# Altium schematic sheet PageMain.SchDoc
size 420 x 297 mm; Address1: Address1; Address2: Address2; Address3: Address3; Address4: Address4; DocumentNumber: ADHF20_EL; SheetNumber: 1; Scale: 1:1; DocumentType: Схема электрическая принципиальная; FirstReferrence: ADHF20_EL
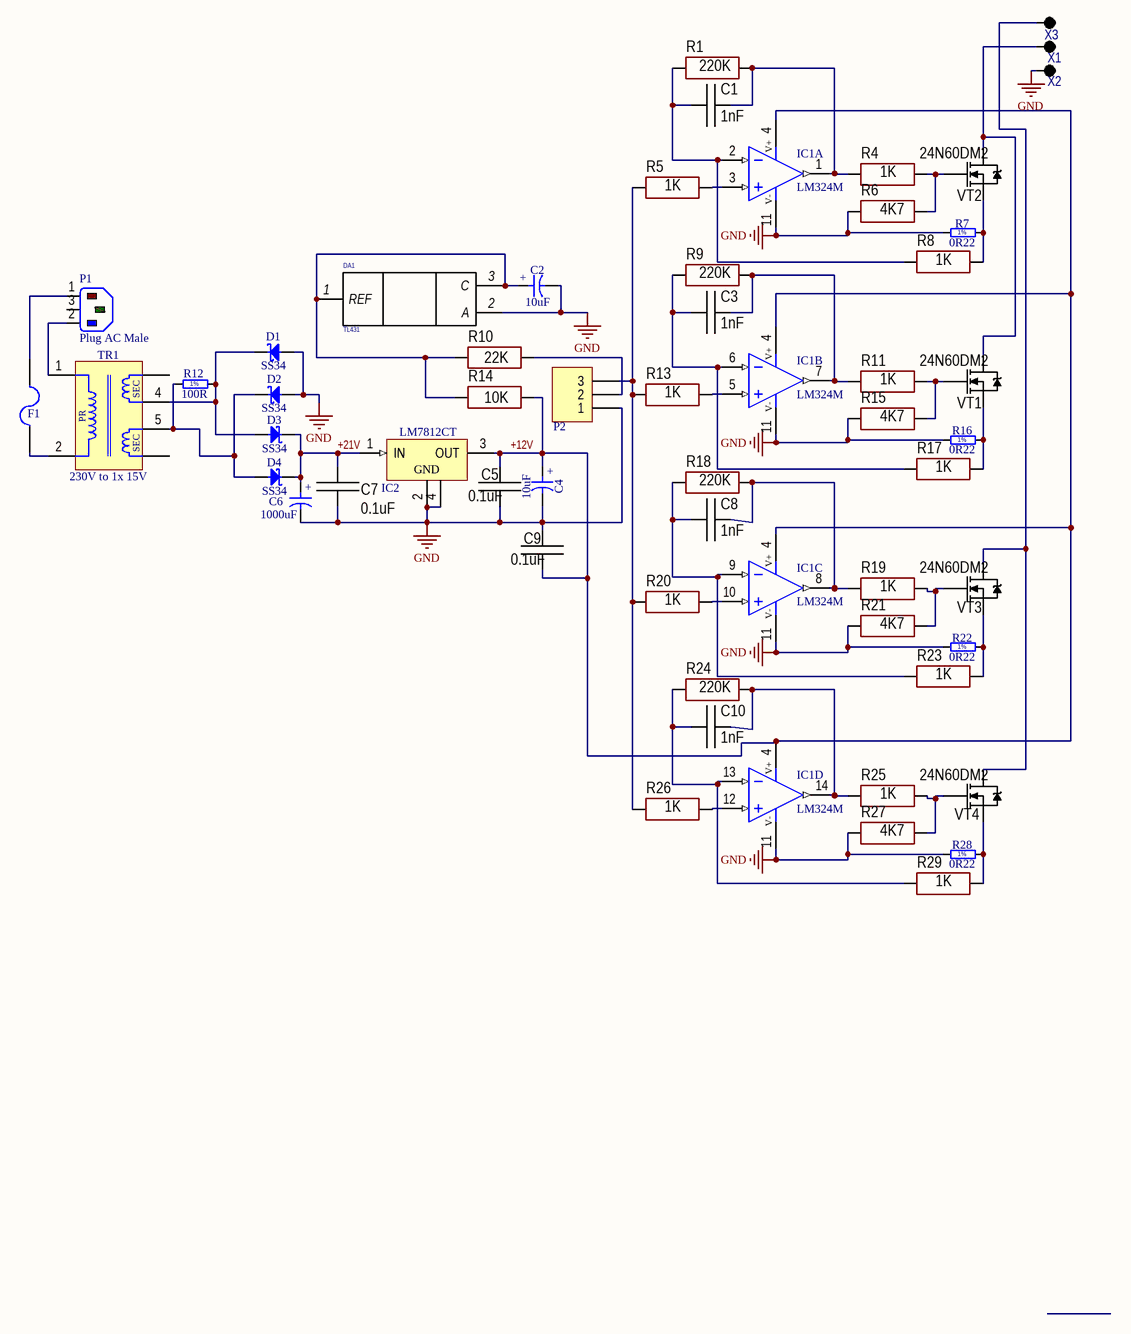
[diagram p0: PageMain.SchDoc]

## Parts
C1  value 1nF  [CAP: 0805]
C2  10uF  [CAPPR200-500X1100]
C3  value 1nF  [CAP: 0805]
C4  10uF  [CAPPR200-500X1100]
C5  value 0.1uF  [CAP: 0805]
C6  1000uF  [CAPPR500-1300X2700]
C7  value 0.1uF  [CAP: 0805]
C8  value 1nF  [CAP: 0805]
C9  value 0.1uF  [CAP: 0805]
C10  value 1nF  [CAP: 0805]
D1  SS34  [DIOM7659X265N]
D2  SS34  [DIOM7659X265N]
D3  SS34  [DIOM7659X265N]
D4  SS34  [DIOM7659X265N]
DA1  TL431  [TO-92]
F1  (no value)  [PIN-W2/E2.8]
IC1  LM324M  [SOIC127P600X175-14N]  (parts A,B,C,D of 4)
IC2  LM7812CT  [TO-220-H]
P1  Plug AC Male  [IEC9.14-2H3]
P2  Header 3  [HDR1X3]  (value not drawn)
R1  value 220K  [RES: 0805]
R4  value 1K  [RES: 0805]
R5  value 1K  [RES: 0805]
R6  value 4K7  [RES: 0805]
R7  0R22  [RES_OHMITE_45]
R8  value 1K  [RES: 0805]
R9  value 220K  [RES: 0805]
R10  value 22K  [RES: 0805]
R11  value 1K  [RES: 0805]
R12  100R  [RES_OHMITE_45]
R13  value 1K  [RES: 0805]
R14  value 10K  [RES: 0805]
R15  value 4K7  [RES: 0805]
R16  0R22  [RES_OHMITE_45]
R17  value 1K  [RES: 0805]
R18  value 220K  [RES: 0805]
R19  value 1K  [RES: 0805]
R20  value 1K  [RES: 0805]
R21  value 4K7  [RES: 0805]
R22  0R22  [RES_OHMITE_45]
R23  value 1K  [RES: 0805]
R24  value 220K  [RES: 0805]
R25  value 1K  [RES: 0805]
R26  value 1K  [RES: 0805]
R27  value 4K7  [RES: 0805]
R28  0R22  [RES_OHMITE_45]
R29  value 1K  [RES: 0805]
TR1  230V to 1x 15V  [XFMR_CLAIRTRONIC_14102]
VT1  PartNumber: 24N60DM2  [TO247]
VT2  PartNumber: 24N60DM2  [TO247]
VT3  PartNumber: 24N60DM2  [TO247]
VT4  PartNumber: 24N60DM2  [TO247]
X1  62650-1  [62650-1]  (value not drawn)  (no BOM)
X2  62650-1  [62650-1]  (value not drawn)  (no BOM)
X3  62650-1  [62650-1]  (value not drawn)  (no BOM)

## Nets
GND: C2.2 C4.2 C5.2 C6.2 C7.2 C9.1 D1.2(A) D2.2(A) DA1.2(A) IC1.11(V-) IC2.2(GND) IC2.4(GND) P2.1 R6.1 R7.1 R15.1 R16.1 R21.1 R22.1 R27.1 R28.1 X2.1
+12V: C4.1 C5.1 C9.2 IC1.4(V+) IC2.3(OUT) R14.1
+21V: C6.1 C7.1 D3.1(C) D4.1(C) IC2.1(IN)
NetC1_1: C1.1 IC1.1(OUT) R1.2 R4.1
NetC1_2: C1.2 IC1.2(IN-) R1.1 R8.1
NetC2_1: C2.1 DA1.1(REF) DA1.3(C) R10.2 R14.2
NetC3_1: C3.1 IC1.7(OUT) R9.2 R11.1
NetC3_2: C3.2 IC1.6(IN-) R9.1 R17.1
NetC8_1: C8.1 IC1.8(OUT) R18.2 R19.1
NetC8_2: C8.2 IC1.9(IN-) R18.1 R23.1
NetC10_1: C10.1 IC1.14(OUT) R24.2 R25.1
NetC10_2: C10.2 IC1.13(IN-) R24.1 R29.1
NetD1_1: D1.1(C) D3.2(A) R12.2 TR1.4
NetD2_1: D2.1(C) D4.2(A) R12.1 TR1.5
NetF1_1: F1.1 TR1.2
NetF1_2: F1.2 P1.1(L)
NetIC1_3: IC1.3(IN+) R5.2
NetIC1_5: IC1.5(IN+) R13.2
NetIC1_10: IC1.10(IN+) R20.2
NetIC1_12: IC1.12(IN+) R26.2
NetP1_2: P1.2(N) TR1.1
NetP2_2: P2.2 R10.1
NetP2_3: P2.3 R5.1 R13.1 R20.1 R26.1
NetR4_2: R4.2 R6.2 VT2.1(G)
NetR7_2: R7.2 R8.2 VT2.3(S)
NetR11_2: R11.2 R15.2 VT1.1(G)
NetR16_2: R16.2 R17.2 VT1.3(S)
NetR19_2: R19.2 R21.2 VT3.1(G)
NetR22_2: R22.2 R23.2 VT3.3(S)
NetR25_2: R25.2 R27.2 VT4.1(G)
NetR28_2: R28.2 R29.2 VT4.3(S)
NetVT1_2: VT1.2(D) VT2.2(D) X1.1
NetVT3_2: VT3.2(D) VT4.2(D) X3.1

Not connected (* = marked no-connect by the designer): P1 3(E); TR1 3 6

## Notes on the sheet
- Перв. примен.
- Справ. №
- Подп. и дата
- Инв. № дубл.
- Взам. инв. №
- Разраб.
- Изм.
- Лист
- № докум.
- Подп.
- Дата
- Лит.
- Масса
- Масштаб
- Пров.
- Т.контр.
- Листов
- Инв. № подл.
- Утв.
- Н.контр.
- 2.106-A3
- Копировал
- Формат А3
- (in symbol CAER_10UF_63V_20%_PANASONIC_ECA1JM100) +
- (in symbol CAER_1000UF_35V_20%_VISHAY_MAL215050102E3) +
- (in symbol RWW_0R5_1%_5W_90PPM_OHMITE_45) 1%
- (in symbol XFMR_CLAIRTRONIC_14102) SEC; PR

## Library data of the parts
C1 C3 C8 C10 = Ceramic_0805: Manufacturer: Yageo; PartNumber: CC0805KRX7R7BB104; ValueManufacturerPartNumber: Ceramic capacitor, 1nF, X7R, ±10%, 16V, 0805, -55...+125°C; TypeCapacitor: Ceramic capacitor; Tolerance: ±10%; TypeDielectric: X7R; Voltage: 16V; Package: 0805; HelpURL: https://www.digikey.com/product-detail/en/yageo/CC0805KRX7R7BB104/311-1142-1-ND/303052; Temperature: -55...+125°C
C2 C4 = CAER_10UF_63V_20%_PANASONIC_ECA1JM100: Polarised capacitor; Part Description: Aluminum Electrolytic Capacitor (Series: M Type: A); Voltage: 63V; Tolerance: ±20%; Part Number: CAER_10UF_63V_20%_PANASONIC_ECA1JM100; Component Kind: Standard; Component Type: Standard; Pin Count: 2; Value: 10uF; Status: None; Manufacturer: PANASONIC; Manufacturer Part Number: ECA1JM100; Case: LS2 D5 x H11; Mounted: Yes; Socket: No; SMD: No; Sense: No; ComponentHeight: 11mm; HelpURL: \\cern.ch\dfs\Applications\Altium\Datasheets\CAER_PANASONIC_M.pdf; Author: CERN DEM JLC; CreateDate: 04.03.2009; LatestRevisionDate: 04.03.2009
C5 C7 C9 = Ceramic_0805: Manufacturer: Yageo; PartNumber: CC0805KRX7R7BB104; ValueManufacturerPartNumber: Ceramic capacitor, 0.1uF, X7R, ±10%, 16V, 0805, -55...+125°C; TypeCapacitor: Ceramic capacitor; Tolerance: ±10%; TypeDielectric: X7R; Voltage: 16V; Package: 0805; HelpURL: https://www.digikey.com/product-detail/en/yageo/CC0805KRX7R7BB104/311-1142-1-ND/303052; Temperature: -55...+125°C
C6 = CAER_1000UF_35V_20%_VISHAY_MAL215050102E3: Polarised capacitor; Part Description: Radial Miniature, Low Impedance (Z= 0R029) Aluminum Electrolytic Capacitor, (150 RMI Series); Manufacturer: VISHAY BCCOMPONENTS; Voltage: 35V; Tolerance: ±20%; Part Number: CAER_1000UF_35V_20%_VISHAY_MAL215050102E3; Component Kind: Standard; Component Type: Standard; Pin Count: 2; Value: 1000uF; Status: None; Manufacturer Part Number: MAL215050102E3; Case: LS5 D12.5 x H25; Mounted: Yes; Socket: No; SMD: No; Sense: No; ComponentHeight: 27mm; HelpURL: \\cern.ch\dfs\Applications\Altium\Datasheets\CAER_VISHAY_150 RMI.pdf; Author: CERN DEM JLC; CreateDate: 12.03.2015; LatestRevisionDate: 12.03.2015
D1-D4 = SS34: Schottky Diode; Part Description: Surface Mount Schottky Barrier Rectifier; Manufacturer: FAIRCHILD SEMICONDUCTOR; Voltage: 40V; Power: 3A; PressFit: No; Bonding: No; Part Number: SS34; Component Kind: Standard; Component Type: Standard; Device: SS34; PackageDescription: DO-214-AB/SMC Molded Diode, Body 7.95x5.9mm, IPC Medium Density; Manufacturer Part Number: SS34; Pin Count: 2; Case: DO-214AC; Mounted: Yes; Socket: No; SMD: Yes; Sense: No; ComponentHeight: 2.65mm; HelpURL: \\cern.ch\dfs\Applications\Altium\Datasheets\SS34.pdf; Author: CERN DEM JLC; CreateDate: 23.08.2010; LatestRevisionDate: 23.08.2010
DA1 = TL431: *; Part Number: TL431; Package: TO-92; Footprint Patch: ic.PcbLib; BOM: TL431; ComponentType: Микросхема; ComponentLink1URL: http://www.ti.com/lit/ds/symlink/tl431.pdf; ComponentLink1Description: Datasheet; Manufacturer: *; Category: ICs
F1 = Fuse 2: Fuse; Published: 8-Jun-2000; LatestRevisionDate: 17-Jul-2002; LatestRevisionNote: Re-released for DXP Platform.; PackageReference: PIN-W2/E2.8; Publisher: Altium Limited; PackageDescription: Thru-Hole; 2 Leads
IC1 = LM324M: Quad Operational Amplifier; Manufacturer: FAIRCHILD SEMICONDUCTOR; PressFit: No; Bonding: No; Part Number: LM324M; Component Kind: Standard; Component Type: Standard; Device: LM324M; PackageDescription: SOIC 14, Pitch 1.27mm - Body 4x8.75mm, IPC Medium Density; Status: Not recommended; Part Description: Quad Operational Amplifier; Manufacturer Part Number: LM324M; Pin Count: 14; Case: SOIC14; Mounted: Yes; Socket: No; SMD: Yes; Sense: No; ComponentHeight: 1.80mm; Author: CERN DEM JLC; HelpURL: \\cern.ch\dfs\Applications\Altium\Datasheets\LM324M.pdf; CreateDate: 20.08.2008; LatestRevisionDate: 20.08.2008
IC2 = LM7812CT_h: 3-Terminal Regulator 1=IN 2=GND 3=OUT 4=GND; Part Description: 3-Terminal 12V 1A Positive Voltage Regulator; Manufacturer: FAIRCHILD SEMICONDUCTOR; PressFit: No; Bonding: No; Part Number: LM7812CT_h; Component Kind: Standard; Component Type: Standard; Device: LM7812CT; PackageDescription: TO-220 3-Terminal + Tab - Horizontal Mount; Manufacturer Part Number: LM7812CT; Pin Count: 4; Case: TO-220; Mounted: Yes; Socket: No; SMD: No; Sense: No; ComponentHeight: 4.7mm; HelpURL: \\cern.ch\dfs\Applications\Altium\Datasheets\LM7812CT.pdf; Author: CERN DEM JLC; CreateDate: 29.10.2008; LatestRevisionDate: 29.10.2008
P1 = Plug AC Male: IEC Mains Power Inlet, EN60 320-1 C14 Class I Cold Condition, PC Flange Rear Mount, Chassis Plug; PackageDocument: ver.80, 15-Sep-2003; MaximumRating: 10A, 250V a.c. (UL & CSA 15A, 250V a.c.); MountingFixtures: Not drawn on schematic symbol.; PCB_Layout: Complies with manufacturer's recommendation.; DrillSize: Corresponds to nominal value.; Note: IEC Color Scheme employed for L, N and E.; Published: 15-Jul-2004; LatestRevisionDate: 15-Jul-2004; LatestRevisionNote: Component Replaced.; DatasheetDocument: ver.80, 15-Sep-2003; PackageReference: PX0580/PC; Publisher: Altium Limited; Terminations: P.C. Spills; ComponentLink1Description: Manufacturer Link; ComponentLink1URL: http://www.bulgin.co.uk/
P2 = Header 3: Header, 3-Pin; LatestRevisionDate: 17-Jul-2002; LatestRevisionNote: Re-released for DXP Platform.; Publisher: Altium Limited
R1 R9 R18 R24 = Resistor_0805: Manufacturer: Yageo; PartNumber: RC0805JR-07100RL; ValueManufacturerPartNumber: Resistor film, 220K, ±5%, 0805, 0.125W, -55...+125°C; TypeResistor: Resistor film; Power: 0.125W; Tolerance: ±5%; Package: 0805; HelpURL: https://www.digikey.com/product-detail/en/yageo/RC0805JR-07100RL/311-100ARCT-ND/731185; Temperature: -55...+125°C
R4 R5 R8 R11 R13 R17 R19 R20 R23 R25 R26 R29 = Resistor_0805: Manufacturer: Yageo; PartNumber: RC0805JR-07100RL; ValueManufacturerPartNumber: Resistor film, 1K, ±5%, 0805, 0.125W, -55...+125°C; TypeResistor: Resistor film; Power: 0.125W; Tolerance: ±5%; Package: 0805; HelpURL: https://www.digikey.com/product-detail/en/yageo/RC0805JR-07100RL/311-100ARCT-ND/731185; Temperature: -55...+125°C
R6 R15 R21 R27 = Resistor_0805: Manufacturer: Yageo; PartNumber: RC0805JR-07100RL; ValueManufacturerPartNumber: Resistor film, 4K7, ±5%, 0805, 0.125W, -55...+125°C; TypeResistor: Resistor film; Power: 0.125W; Tolerance: ±5%; Package: 0805; HelpURL: https://www.digikey.com/product-detail/en/yageo/RC0805JR-07100RL/311-100ARCT-ND/731185; Temperature: -55...+125°C
R7 R12 R16 R22 R28 = RWW_0R5_1%_5W_90PPM_OHMITE_45: Resistor; Power: 5W; PressFit: No; Component Kind: Standard; Component Type: Standard; Pin Count: 2; Status: None; Case: LS29.4 L23.8 x D8.7; Mounted: Yes; Sense: No; Socket: No; SMD: No; ComponentHeight: 8.7mm; HelpURL: \\cern.ch\dfs\Applications\Altium\Datasheets\RWW_OHMITE_40.pdf; Author: CERN DEM MR; CreateDate: 27.04.2016; LatestRevisionDate: 27.04.2016
  R7 R16 R22 R28: Value: 0R22
  R12: Value: 100R
R10 = Resistor_0805: Manufacturer: Yageo; PartNumber: RC0805JR-07100RL; ValueManufacturerPartNumber: Resistor film, 22K, ±5%, 0805, 0.125W, -55...+125°C; TypeResistor: Resistor film; Power: 0.125W; Tolerance: ±5%; Package: 0805; HelpURL: https://www.digikey.com/product-detail/en/yageo/RC0805JR-07100RL/311-100ARCT-ND/731185; Temperature: -55...+125°C
R14 = Resistor_0805: Manufacturer: Yageo; PartNumber: RC0805JR-07100RL; ValueManufacturerPartNumber: Resistor film, 10K, ±5%, 0805, 0.125W, -55...+125°C; TypeResistor: Resistor film; Power: 0.125W; Tolerance: ±5%; Package: 0805; HelpURL: https://www.digikey.com/product-detail/en/yageo/RC0805JR-07100RL/311-100ARCT-ND/731185; Temperature: -55...+125°C
TR1 = XFMR_CLAIRTRONIC_14102: Transformer 1xPrim 1xSec Type1; Part Description: 220V to 1x15V 4.5VA Encapsulated Transformer; Manufacturer: CLAIRTRONIC LTD; Manufacturer Part Number: 14102; Part Number: XFMR_CLAIRTRONIC_14102; Component Kind: Standard; Component Type: Standard; Pin Count: 6; Value: 230V to 1x 15V; Status: Obsolete; Mounted: Yes; Socket: No; Sense: No; SMD: No; ComponentHeight: 26mm; Author: CERN DEM JMW; CreateDate: 11.07.2008; LatestRevisionDate: 15.07.2008
VT1-VT4 = MOSFET_N_123: Manufacturer: Infineon Technologies; ValueManufacturerPartNumber: MOSFET N-channel transistor, 80V, 7A, 9.1nC, 2.5W, 34mOhm, 756pF, 8-TDSON, -55...+150°C; TypeTransistor: MOSFET N-channel transistor; VoltageDS: 80V; CurrentDS: 7A; RDS: 34mOhm; GateCharge: 9.1nC; InputCapacitor: 756pF; MaxPower: 2.5W; Package: 8-TDSON; HelpURL: https://www.digikey.com/product-detail/en/infineon-technologies/BSC340N08NS3GATMA1/BSC340N08NS3GATMA1TR-ND/2080655; Temperature: -55...+150°C
X1-X3 = 62650-1: Ножевой контакт 6,3мм на плату; Manufacturer: TE Connectivity; BOM: 62650-1, TE Connectivity; Part Number: 62650-1; Footprint Patch: connector.PcbLib; ComponentType: Соединитель; ComponentLink1URL: http://www.farnell.com/datasheets/1650963.pdf; ComponentLink1Description: Datasheet; Category: CONNECTOR